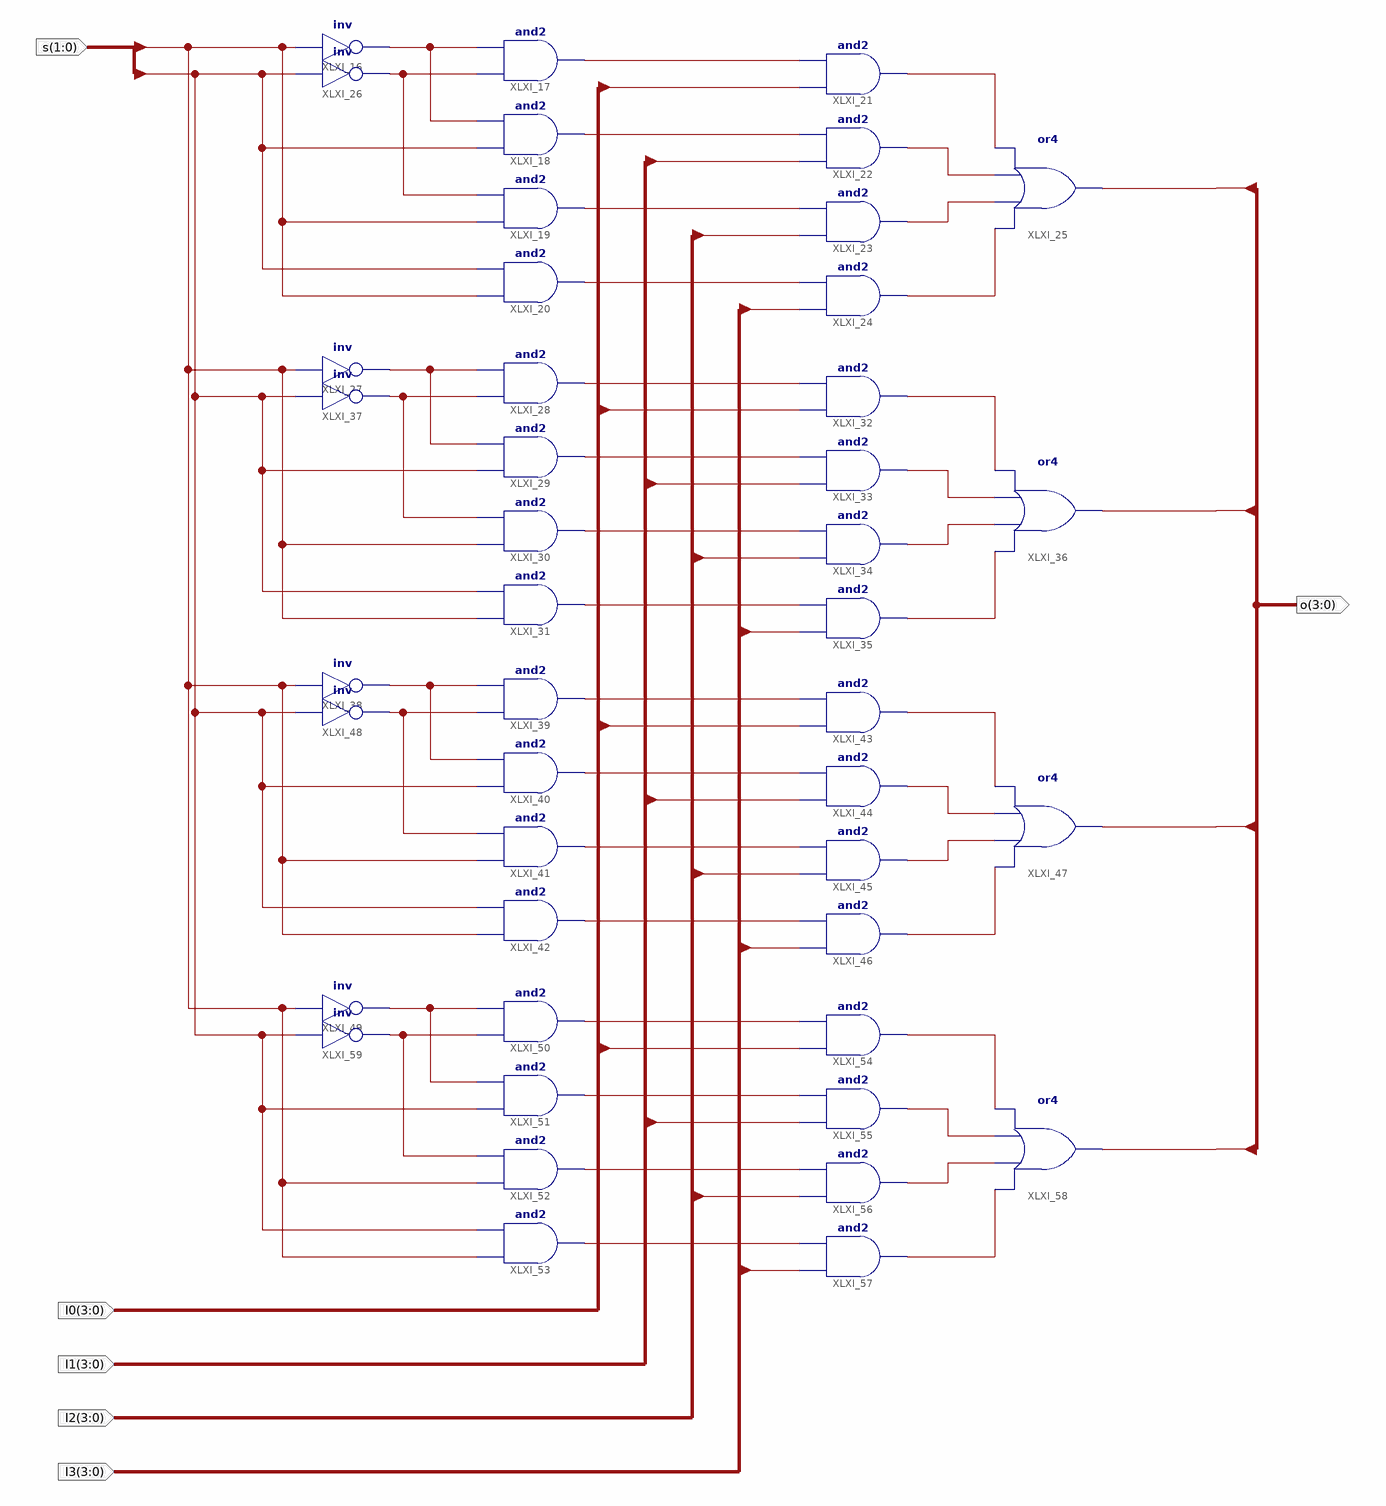
[diagram p0: schematic sheet 1]
// Xilinx ISE schematic MUX441_sch.sch (kintex7) as structural Verilog: 44 symbols, 6 ports
module MUX441_sch (
  input  [1:0] s,
  input  [3:0] I0,
  input  [3:0] I1,
  input  [3:0] I2,
  input  [3:0] I3,
  output [3:0] o
);

  wire XLXN_38, XLXN_39, XLXN_40, XLXN_41, XLXN_42, XLXN_49, XLXN_50, XLXN_51, XLXN_52, XLXN_54, XLXN_59,
       XLXN_60, XLXN_61, XLXN_62, XLXN_63, XLXN_64, XLXN_65, XLXN_66, XLXN_67, XLXN_69, XLXN_72, XLXN_73,
       XLXN_74, XLXN_75, XLXN_76, XLXN_77, XLXN_78, XLXN_79, XLXN_80, XLXN_82, XLXN_85, XLXN_86, XLXN_87,
       XLXN_88, XLXN_89, XLXN_90, XLXN_91, XLXN_92, XLXN_93, XLXN_95;

  not XLXI_16 (XLXN_52, s[1]);
  and XLXI_17 (XLXN_42, XLXN_54, XLXN_52);
  and XLXI_18 (XLXN_49, s[0], XLXN_52);
  and XLXI_19 (XLXN_50, s[1], XLXN_54);
  and XLXI_20 (XLXN_51, s[1], s[0]);
  not XLXI_26 (XLXN_54, s[0]);
  not XLXI_27 (XLXN_67, s[1]);
  and XLXI_28 (XLXN_63, XLXN_69, XLXN_67);
  and XLXI_29 (XLXN_64, s[0], XLXN_67);
  and XLXI_30 (XLXN_65, s[1], XLXN_69);
  and XLXI_31 (XLXN_66, s[1], s[0]);
  not XLXI_37 (XLXN_69, s[0]);
  not XLXI_38 (XLXN_80, s[1]);
  and XLXI_39 (XLXN_76, XLXN_82, XLXN_80);
  and XLXI_40 (XLXN_77, s[0], XLXN_80);
  and XLXI_41 (XLXN_78, s[1], XLXN_82);
  and XLXI_42 (XLXN_79, s[1], s[0]);
  not XLXI_48 (XLXN_82, s[0]);
  not XLXI_49 (XLXN_93, s[1]);
  and XLXI_50 (XLXN_89, XLXN_95, XLXN_93);
  and XLXI_51 (XLXN_90, s[0], XLXN_93);
  and XLXI_52 (XLXN_91, s[1], XLXN_95);
  and XLXI_53 (XLXN_92, s[1], s[0]);
  not XLXI_59 (XLXN_95, s[0]);
  and XLXI_21 (XLXN_38, I0[0], XLXN_42);
  and XLXI_22 (XLXN_39, I1[0], XLXN_49);
  and XLXI_23 (XLXN_40, I2[0], XLXN_50);
  or XLXI_25 (o[0], XLXN_41, XLXN_40, XLXN_39, XLXN_38);
  and XLXI_32 (XLXN_59, I0[1], XLXN_63);
  and XLXI_33 (XLXN_60, I1[1], XLXN_64);
  and XLXI_34 (XLXN_61, I2[1], XLXN_65);
  and XLXI_35 (XLXN_62, I3[1], XLXN_66);
  or XLXI_36 (o[1], XLXN_62, XLXN_61, XLXN_60, XLXN_59);
  and XLXI_43 (XLXN_72, I0[2], XLXN_76);
  and XLXI_44 (XLXN_73, I1[2], XLXN_77);
  and XLXI_45 (XLXN_74, I2[2], XLXN_78);
  and XLXI_46 (XLXN_75, I3[2], XLXN_79);
  or XLXI_47 (o[2], XLXN_75, XLXN_74, XLXN_73, XLXN_72);
  and XLXI_54 (XLXN_85, I0[3], XLXN_89);
  and XLXI_55 (XLXN_86, I1[3], XLXN_90);
  and XLXI_56 (XLXN_87, I2[3], XLXN_91);
  and XLXI_57 (XLXN_88, I3[3], XLXN_92);
  or XLXI_58 (o[3], XLXN_88, XLXN_87, XLXN_86, XLXN_85);
  and XLXI_24 (XLXN_41, I3[0], XLXN_51);
endmodule
